# Altium schematic sheet PA_MCU.SchDoc: Приемопередатчик  SDR200
size 420 x 297 mm; Author: В.Титов; DrawnBy: В.Титов; DocumentNumber: ХХХХ.468179.001 Э3; SheetNumber: 1; SheetTotal: 2; DocumentType: Схема электрическая принципиальная; Title2: Усилитель мощности; Scale: 1:1
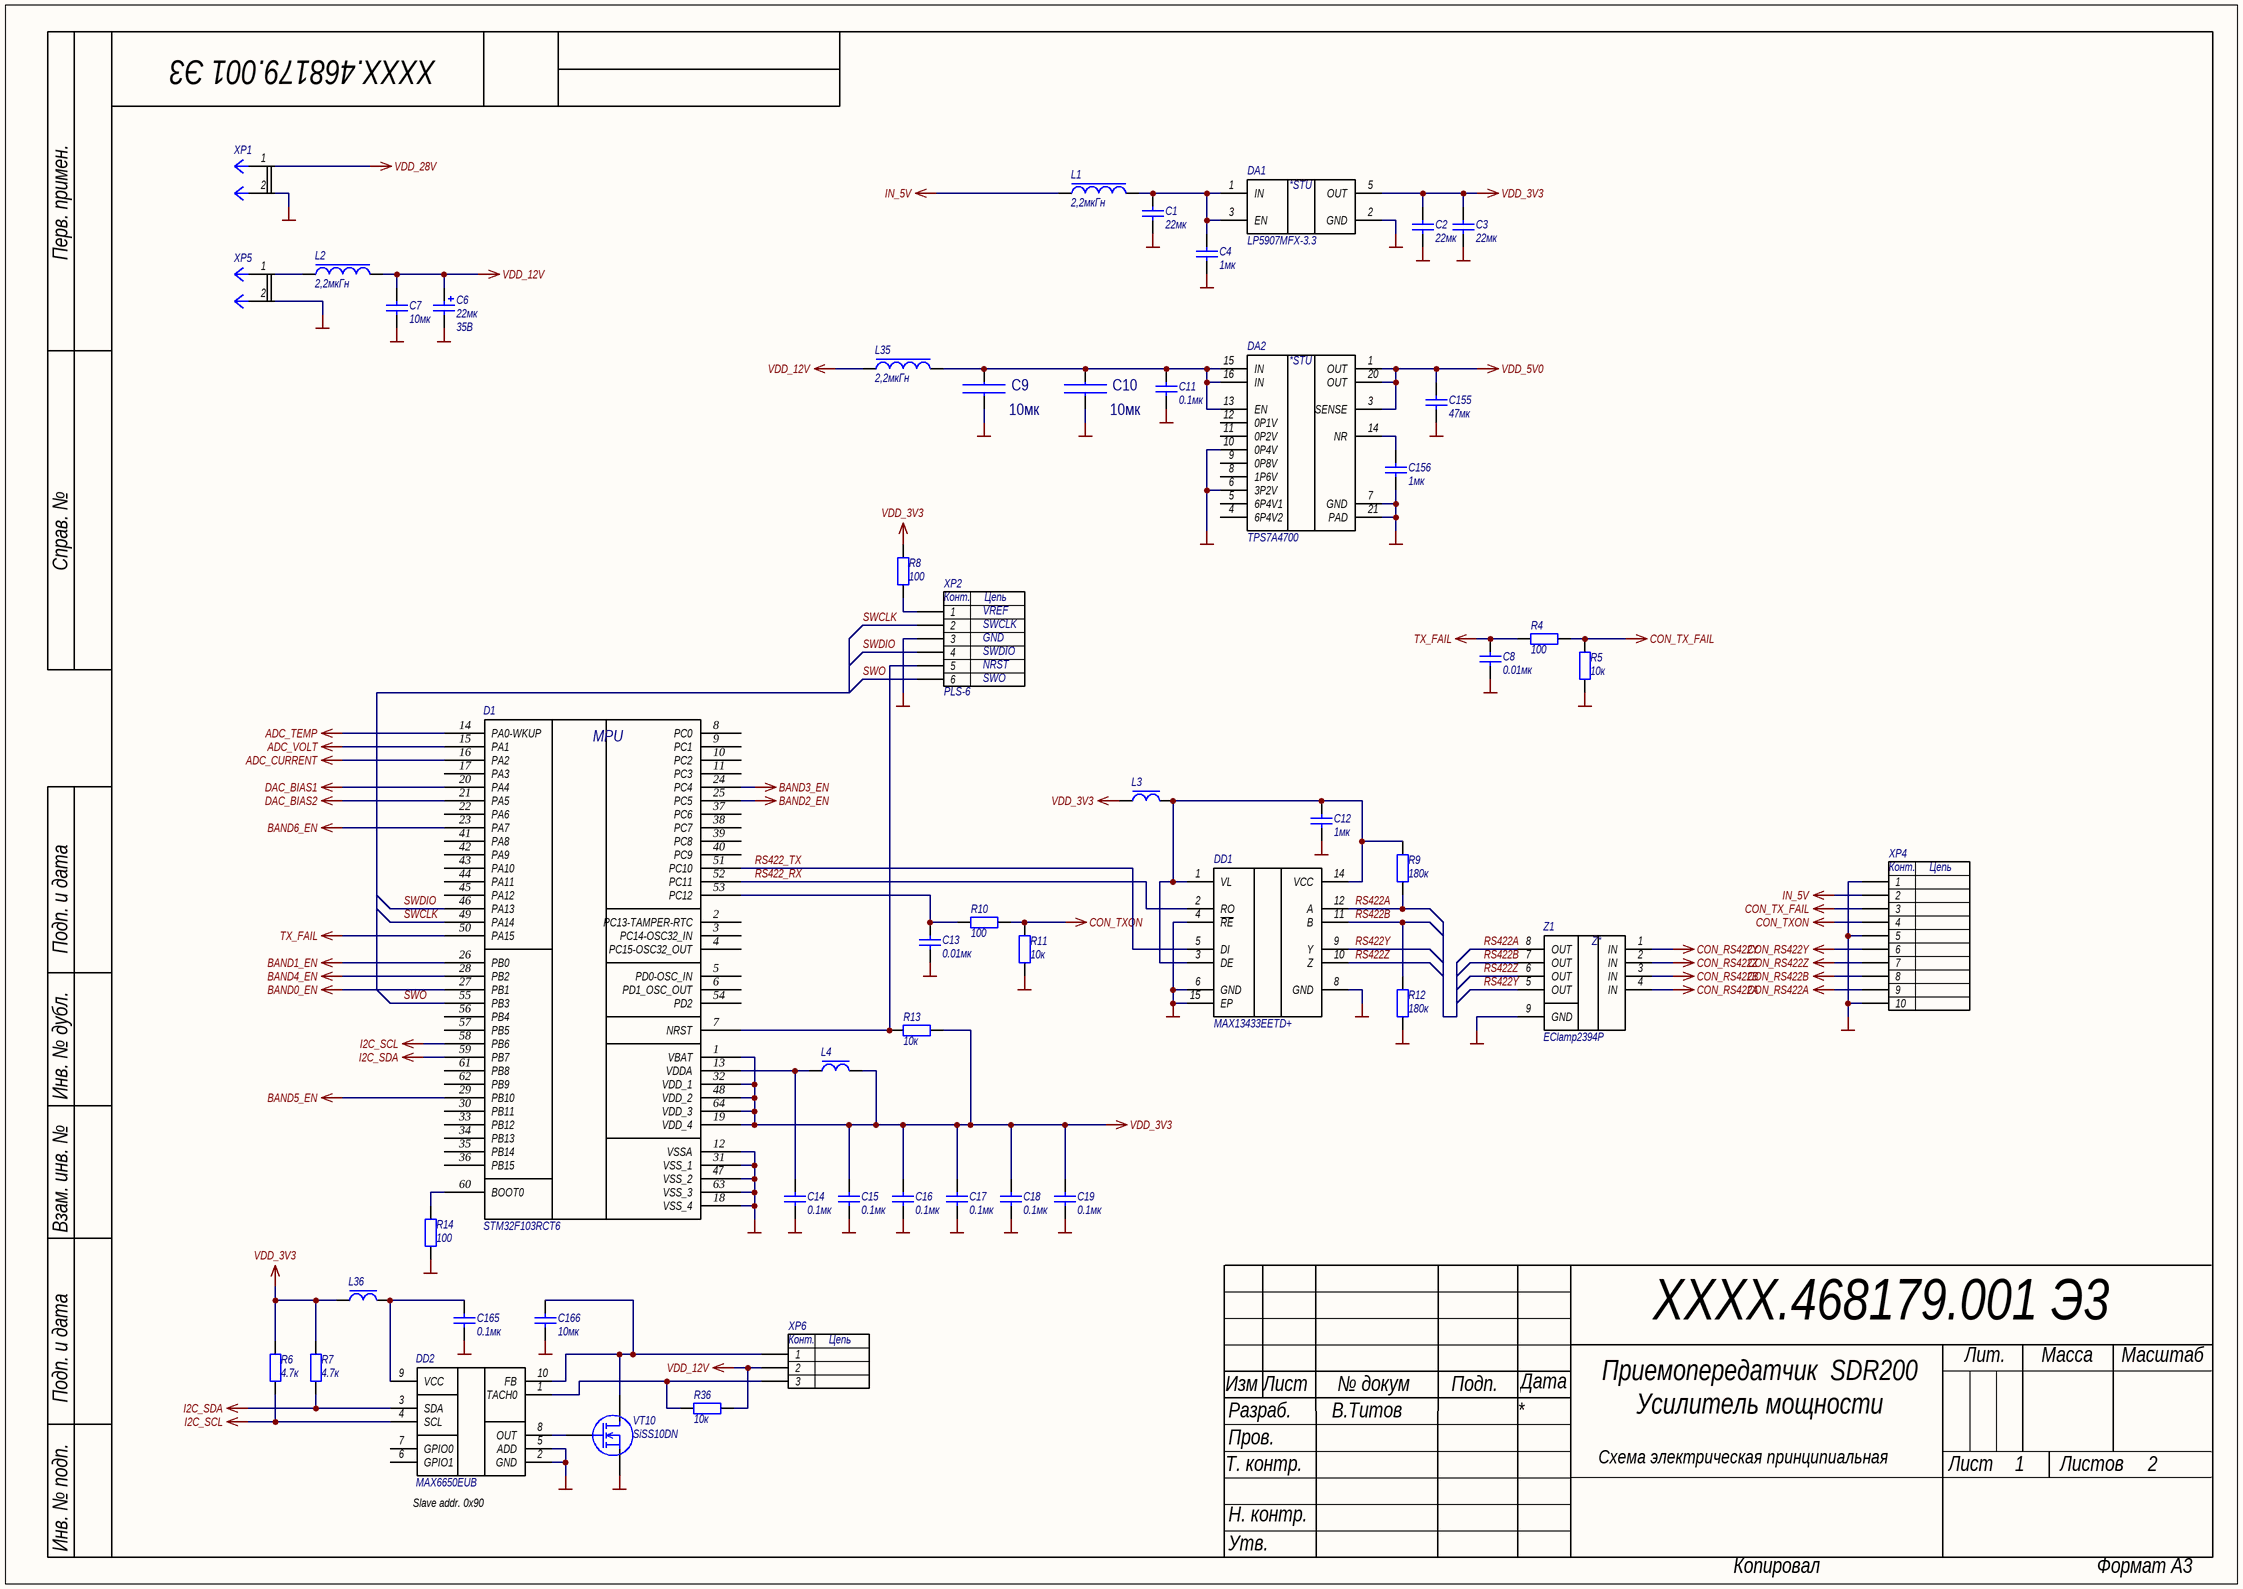
[diagram p0: PA_MCU.SchDoc]

## Parts
C1  22мк  [CAPC2012X12L]
C2  22мк  [CAPC2012X12L]
C3  22мк  [CAPC2012X12L]
C4  1мк  [CAPC1005X06N]
C6  Power/Voltage: 35В  [CAPMP7343X28L]  (hidden comment: 22мк)
C7  10мк  [CAPC3225X27L]
C8  0.01мк  [CAPC1005X06N]
C9  Nominal: 10мк  [CAPC2012X09L]  (hidden comment: CC0805KKX5R8BB106)
C10  Nominal: 10мк  [CAPC2012X09L]  (hidden comment: CC0805KKX5R8BB106)
C11  0.1мк  [CAPC1005X06N]
C12  1мк  [CAPC1005X06N]
C13  0.01мк  [CAPC1005X06N]
C14  0.1мк  [CAPC1005X06N]
C15  0.1мк  [CAPC1005X06N]
C16  0.1мк  [CAPC1005X06N]
C17  0.1мк  [CAPC1005X06N]
C18  0.1мк  [CAPC1005X06N]
C19  0.1мк  [CAPC1005X06N]
C155  47мк  [CAPC2012X12L]
C156  1мк  [CAPC1005X06N]
C165  0.1мк  [CAPC1005X06N]
C166  10мк  [CAPC3225X27L]
D1  STM32F103RCT6  [QFP50P1200X1200X160-64N]
DA1  LP5907MFX-3.3  [SOT23-5AM]
DA2  TPS7A4700  [QFN65P500X500X100_HS-21L]
DD1  MAX13433EETD+  [SON40P300X80_HS-15L]
DD2  MAX6650EUB  [TSSOP50P490X110-10N]
L1  2,2мкГн  [CSAB0420]
L2  2,2мкГн  [CSAB0420]
L3  BLM18PG121SN1D  [INDC1608X08L]  (value not drawn)
L4  BLM18PG121SN1D  [INDC1608X08L]  (value not drawn)
L35  2,2мкГн  [CSAB0420]
L36  BLM18PG121SN1D  [INDC1608X08L]  (value not drawn)
R4  100  [RESC1005X06N]
R5  10к  [RESC1005X06N]
R6  4.7к  [RESC1005X06N]
R7  4.7к  [RESC1005X06N]
R8  100  [RESC1005X06N]
R9  180к  [RESC1005X06N]
R10  100  [RESC1005X06N]
R11  10к  [RESC1005X06N]
R12  180к  [RESC1005X06N]
R13  10к  [RESC1005X06N]
R14  100  [RESC1005X06N]
R36  10к  [RESC1005X06N]
VT10  SiSS10DN  [PowerPAK_1212-8W]
XP1  XT60-F  [XT60-F]  (value not drawn)
XP2  PLS-6  [HDR1X6]
XP4  FH12-10S-0.5SVA  [FH12-10S-0.5SH]  (value not drawn)
XP5  XT30UPB-M  [XT30UPB-M]  (value not drawn)
XP6  22232031  [22232031]  (value not drawn)
Z1  EClamp2394P  [SON50P160X65_HS-9N]

## Nets
ADC_CURRENT: D1.16(PA2)
ADC_TEMP: D1.14(PA0-WKUP)
ADC_VOLT: D1.15(PA1)
BAND0_EN: D1.27(PB1)
BAND1_EN: D1.26(PB0)
BAND2_EN: D1.25(PC5)
BAND3_EN: D1.24(PC4)
BAND4_EN: D1.28(PB2)
BAND5_EN: D1.29(PB10)
BAND6_EN: D1.23(PA7)
CON_RS422A: XP4.9 Z1.4(IN)
CON_RS422B: XP4.8 Z1.3(IN)
CON_RS422Y: XP4.6 Z1.1(IN)
CON_RS422Z: XP4.7 Z1.2(IN)
CON_TX_FAIL: R4.1 R5.1 XP4.3
CON_TXON: R10.1 R11.1 XP4.4
DAC_BIAS1: D1.20(PA4)
DAC_BIAS2: D1.21(PA5)
GND: C1.1 C2.1 C3.1 C4.1 C6.1 C7.1 C8.1 C11.1 C12.1 C13.1 C14.1 C15.1 C16.1 C17.1 C18.1 C19.1 C155.1 C156.1 C165.1 C166.1 D1.12(VSSA) D1.18(VSS_4) D1.31(VSS_1) D1.47(VSS_2) D1.63(VSS_3) DA1.2(GND) DA2.6(3P2V) DA2.7(GND) DA2.10(0P4V) DA2.21(PAD) DD1.4(~{RE}) DD1.6(GND) DD1.8(GND) DD1.15(EP) DD2.2(GND) DD2.5(ADD) R5.2 R11.2 R12.1 R14.2 VT10.S XP1.2 XP2.3 XP4.1 XP4.5 XP4.10 XP5.2 Z1.9(GND)
I2C_SCL: D1.58(PB6) DD2.4(SCL) R6.1
I2C_SDA: D1.59(PB7) DD2.3(SDA) R7.1
IN_5V: L1.1 XP4.2
TX_FAIL: C8.2 D1.50(PA15) R4.2
VDD_3V3: C2.2 C3.2 C15.2 C16.2 C17.2 C18.2 C19.2 D1.1(VBAT) D1.19(VDD_4) D1.32(VDD_1) D1.48(VDD_2) D1.64(VDD_3) DA1.5(OUT) L3.1 L4.2 L36.1 R6.2 R7.2 R8.1 R13.2
VDD_5V0: C155.2 DA2.1(OUT) DA2.3(SENSE) DA2.20(OUT)
VDD_12V: C6.2 C7.2 L2.2 L35.1 R36.2 XP6.2
VDD_28V: XP1.1
RS422_RX: D1.52(PC11) DD1.2(RO)
RS422_TX: D1.51(PC10) DD1.5(DI)
RS422A: DD1.12(A) R9.1 Z1.8(OUT)
RS422B: DD1.11(B) R12.2 Z1.7(OUT)
RS422Y: DD1.9(Y) Z1.5(OUT)
RS422Z: DD1.10(Z) Z1.6(OUT)
SWCLK: D1.49(PA14) XP2.2
SWDIO: D1.46(PA13) XP2.4
SWO: D1.55(PB3) XP2.6
NetC1_2: C1.2 C4.2 DA1.1(IN) DA1.3(EN) L1.2
NetC9_2: C9.2 C10.2 C11.2 DA2.13(EN) DA2.15(IN) DA2.16(IN) L35.2
NetC12_2: C12.2 DD1.1(VL) DD1.3(DE) DD1.14(VCC) L3.2 R9.2
NetC13_2: C13.2 D1.53(PC12) R10.2
NetC14_2: C14.2 D1.13(VDDA) L4.1
NetC156_2: C156.2 DA2.14(NR)
NetC165_2: C165.2 DD2.9(VCC) L36.2
NetC166_2: C166.2 DD2.10(FB) VT10.D XP6.1
NetD1_7: D1.7(NRST) R13.1 XP2.5
NetD1_60: D1.60(BOOT0) R14.1
NetDD2_1: DD2.1(TACH0) R36.1 XP6.3
NetDD2_8: DD2.8(OUT) VT10.G
NetL2_1: L2.1 XP5.1
NetR8_2: R8.2 XP2.1

Not connected (* = marked no-connect by the designer): C9 1; C10 1; D1 2(PC13-TAMPER-RTC) 3(PC14-OSC32_IN) 4(PC15-OSC32_OUT) 5(PD0-OSC_IN) 6(PD1_OSC_OUT) 8(PC0) 9(PC1) 10(PC2) 11(PC3) 17(PA3) 22(PA6) 30(PB11) 33(PB12) 34(PB13) 35(PB14) 36(PB15) 37(PC6) 38(PC7) 39(PC8) 40(PC9) 41(PA8) 42(PA9) 43(PA10) 44(PA11) 45(PA12) 54(PD2) 56(PB4) 57(PB5) 61(PB8) 62(PB9); DA2 4(6P4V2) 5(6P4V1) 8(1P6V) 9(0P8V) 11(0P2V) 12(0P1V); DD2 6(GPIO1) 7(GPIO0)

## Notes on the sheet
- (near XP2) VREF
- (near XP2) SWCLK
- (near XP2) GND
- (near XP2) SWDIO
- (near XP2) NRST
- (near XP2) SWO
- (near DD2) Slave addr. 0x90
- Перв. примен.
- Справ. №
- Подп. и дата
- Инв. № дубл.
- Взам. инв. №
- Изм
- Лист
- № докум
- Подп.
- Дата
- Лит.
- Масса
- Масштаб
- Т. контр.
- Разраб.
- Пров.
- Листов
- Н. контр.
- Инв. № подп.
- Утв.
- Копировал
- Формат А3
- (in symbol Микросхема LP5907MFX-3.3) *STU
- (in symbol Микросхема STM32F103RCT6) MPU
- (in symbol Микросхема TPS7A4700RGW) *STU
- (in symbol Соединитель 22232031) Конт.; Цепь
- (in symbol Соединитель FH12-10S-0.5SVA) Конт.; Цепь
- (in symbol Соединитель PLS-6) Конт.; Цепь
- (in symbol Фильтр EMI EClamp2394P) Z*

## Library data of the parts
C1-C3 = Кер.ЧИП конд. 0805 22мкФ X5R 10% 16В: Кер. ЧИП-конденсатор; Manufacturer: TDK; ManufacturerPartNumber: C2012X5R1C226KT; Power/Voltage: 16В; TKE: X5R; Tolerance: ±10%; Value: 22мк
C4 C12 C156 = Кер.ЧИП конд. 0402 1мкФ X5R 10%, 10В: Кер. ЧИП-конденсатор; Power/Voltage: 10В; TKE: X5R; Tolerance: ±10%; PackageReference: 0402; Value: 1мк
C6 = Конденсатор танталовый SMD D case 22мкФ ±20% 35B: Тант. ЧИП-конденсатор; Tolerance: ±20%; Published: 8-Jun-2000; LatestRevisionDate: 29-May-2009; LatestRevisionNote: IPC-7351 Footprint Added.; Publisher: Altium Limited; PackageDescription: Chip Capacitor; PackageReference: тип D; Value: 22мк
C7 C166 = Кер.ЧИП конд. 1210 10мкФ X5R 20% 50В: Кер. ЧИП-конденсатор; Manufacturer: Murata; ManufacturerPartNumber: GRM32ER71H106; Power/Voltage: 50В; TKE: X5R; Tolerance: ±20%; Value: 10мк
C8 C13 = Кер.ЧИП конд. 0402 0.01мкФ X7R 10%, 50В: Кер. ЧИП-конденсатор; Power/Voltage: 50В; TKE: X7R; Tolerance: ±20%; Value: 0.01мк
C9 C10 = CC0805KKX5R8BB106: ЧИП конденсатор; Manufacturer: Yageo; Tolerance: 0,1; Value: 0805 10 мкФ 25В X7R; Type: X7R; RuNominal: 10 мкФ; Voltage: 25В; ManufacturerPartNumber: CC0805KKX5R8BB106; ID: 0805 10 мкФ 25В X7R; Rem: *
C11 C14-C19 C165 = Кер.ЧИП конд. 0402 0.1мкФ X7R 10%, 16В: Кер. ЧИП-конденсатор; Power/Voltage: 16В; TKE: X7R; Tolerance: ±10%; PackageReference: 0402; Value: 0.1мк
C155 = Кер.ЧИП конд. 0805 47мкФ X5R 20% 10В: Кер. ЧИП-конденсатор; Manufacturer: Murata; ManufacturerPartNumber: GRM21BR61A476ME15L; Power/Voltage: 10В; TKE: X5R; Tolerance: ±20%; Value: 47мк
D1 = Микросхема STM32F103RCT6: Ultra-low-power 32-bit MCU ARM®-based Cortex®-M3, 128KB Flash, 16KB SRAM, 4KB EEPROM, LCD, USB, ADC, DAC; Manufacturer: STMicroelectronics; Published: 29-Jan-2009; Code_JEDEC: MS-026; ComponentLink1Description: Manufacturer Link; ComponentLink3Description: Packaging Specification; Value: STM32F103RCT6
DA1 = Микросхема LP5907MFX-3.3: 250-mA Ultra-Low-Noise, Low-IQ LDO; Manufacturer: TI; Value: LP5907MFX-3.3; ComponentLink1Description: datasheet; ComponentLink1URL: http://www.ti.com/lit/ds/symlink/lp5907.pdf
DA2 = Микросхема TPS7A4700RGW: 36-V, 1-A, 4-µVRMS, RF LDO Voltage Regulator; Manufacturer: TI; Value: TPS7A4700; ComponentLink1Description: datasheet; ComponentLink1URL: http://www.ti.com/lit/ds/symlink/tps7a47.pdf
DD1 = Микросхема MAX13433EETD+: RS-422 Transceivers with Low-Voltage Logic Interface 16M; Manufacturer: Maxim; Value: MAX13433EETD+; ComponentLink1Description: datasheet; ComponentLink1URL: https://datasheets.maximintegrated.com/en/ds/MAX13430E-MAX13433E.pdf
DD2 = Микросхема MAX6650EUB: Fan-Speed Regulators and Monitors with SMBus/I2C-Compatible Interface; Manufacturer: Maxim; Value: MAX6650EUB; ComponentLink1Description: datasheet; ComponentLink1URL: https://www.analog.com/media/en/technical-documentation/data-sheets/MAX6650-MAX6651.pdf
L1 L2 L35 = ЧИП индуктивность CSAB0420-2R2M: Molding Power Choke; Manufacturer: Vishay; ManufacturerPartNumber: IHLP1616ABER1R0M11; Value: 2,2мкГн
L3 L4 L36 = ЧИП дроссель 0603 BLM18PG121SN1D: SMD EMI Suppression Filter EMIFIL; Manufacturer: Murata; ManufacturerPartNumber: BLM18PG121SN1D; Value: BLM18PG121SN1D
R4 R8 R10 R14 = Чип резистор 0402 100 Ом, 5%: ЧИП-резистор; Tolerance: ±5%; TKE: 100 ppm/°С; PackageReference: 0402; Value: 100
R5 R11 R13 R36 = Чип резистор 0402 10 кОм, 5%: ЧИП-резистор; Tolerance: ±5%; TKE: 100 ppm/°С; PackageReference: 0402; Value: 10к
R6 R7 = Чип резистор 0402 4,7 кОм, 5%: ЧИП-резистор; Tolerance: ±5%; TKE: 100 ppm/°С; PackageReference: 0402; Value: 4.7к
R9 R12 = Чип резистор 0402 180 кОм, 5%: ЧИП-резистор; Tolerance: ±5%; TKE: 100 ppm/°С; PackageReference: 0402; Value: 180к
VT10 = ЧИП транзистор SiSS10DN: N-Channel 40 V (D-S) MOSFET; ComponentLink1Description: datasheet; ComponentLink1URL: https://www.vishay.com/docs/65439/siss10dn.pdf; Value: SiSS10DN
XP1 = Соединитель XT60-F: AMASS XT60-F; Value: XT60-F
XP2 = Соединитель PLS-6: Вилка штыревая 2.54мм 1x6 прямая тип1; LatestRevisionDate: 17-Jul-2002; LatestRevisionNote: Re-released for DXP Platform.; Publisher: Altium Limited; Value: PLS-6
XP4 = Соединитель FH12-10S-0.5SVA: 0.5mm  Pitch FPC/FFC Connector FH12 Series; Manufacturer: Hirose; Value: FH12-10S-0.5SVA
XP5 = Соединитель XT30UPB-M: AMASS XT30UPB-M  5 mm; Value: XT30UPB-M
XP6 = Соединитель 22232031: Molex 2,54 мм pitch-3; Manufacturer: Connfly; Value: 22232031
Z1 = Фильтр EMI EClamp2394P: ESD/EMI Protection  for Color LCD Interfaces; Manufacturer: SEMTECH; PackageReference: SLP2116P8; Value: EClamp2394P